# Altium schematic sheet Top Sheet.SchDoc
size Letter; Address4: USA
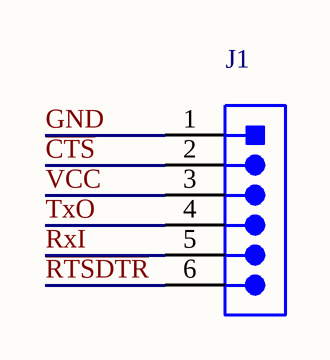
[diagram p0: Top Sheet.SchDoc]

## Parts
J1  6 contacts stacking Male header  [PRPC006SACN-RC]  (value not drawn)

## Nets
~{CTS}: J1.2
~{RTSDTR}: J1.6
GND: J1.1
RxI: J1.5
TxO: J1.4
VCC: J1.3

## Notes on the sheet
- Title:
- Desc:
- Size:
- Date:
- File:
- Repo:
- Letter
- Auth:
- Time:
- Sheet
- Proj:
- of

## Library data of the parts
J1 = PRPC006SACN-RC: Connector Male Header 1X6 vertical 6contacts 0.100in pitch Gold finish THT Stacking; Manufacturer: Sullins Connector Solutions; PCB Package: 1X6 THT; Description in Visual: Con Hdr Male 6contacts vertical 1X6 stack; Number of Contacts: 6; Options: Contact length: 0.648"; P/N: PRPC006SACN-RC; Manufacturer P/N: PRPC006SACN-RC; Orientation: vertical; Number of Rows: 1; Pitch: 0.100in; Contact Finish: Gold; Gender: Male; ComponentLink1Description: Manufacturer Website; ComponentLink1URL: http://www.sullinscorp.com; ComponentLink2Description: Component Datasheet; ComponentLink2URL: https://media.digikey.com/PDF/Data%20Sheets/Sullins%20PDFs/xRxCzzzSxxN-RC_ST_11635-B.pdf; ComponentLink4Description: Product Page; ComponentLink4URL: https://www.sullinscorp.com/product/?pn=PRPC006SACN-RC&toggle=in; ComponentLink3Description: Octopart Link; ComponentLink3URL: https://octopart.com/prpc006sacn-rc-sullins-22265644?r=sp; Supplier 1: Digi-Key; Supplier Part Number 1: S1131EC-06-ND; Supplier Part Number 2: Digi-Key; Supplier 2: TSW-106-22-T-S-RE-ND